# EAGLE design RH021.2 (EAGLE 7.1.0)
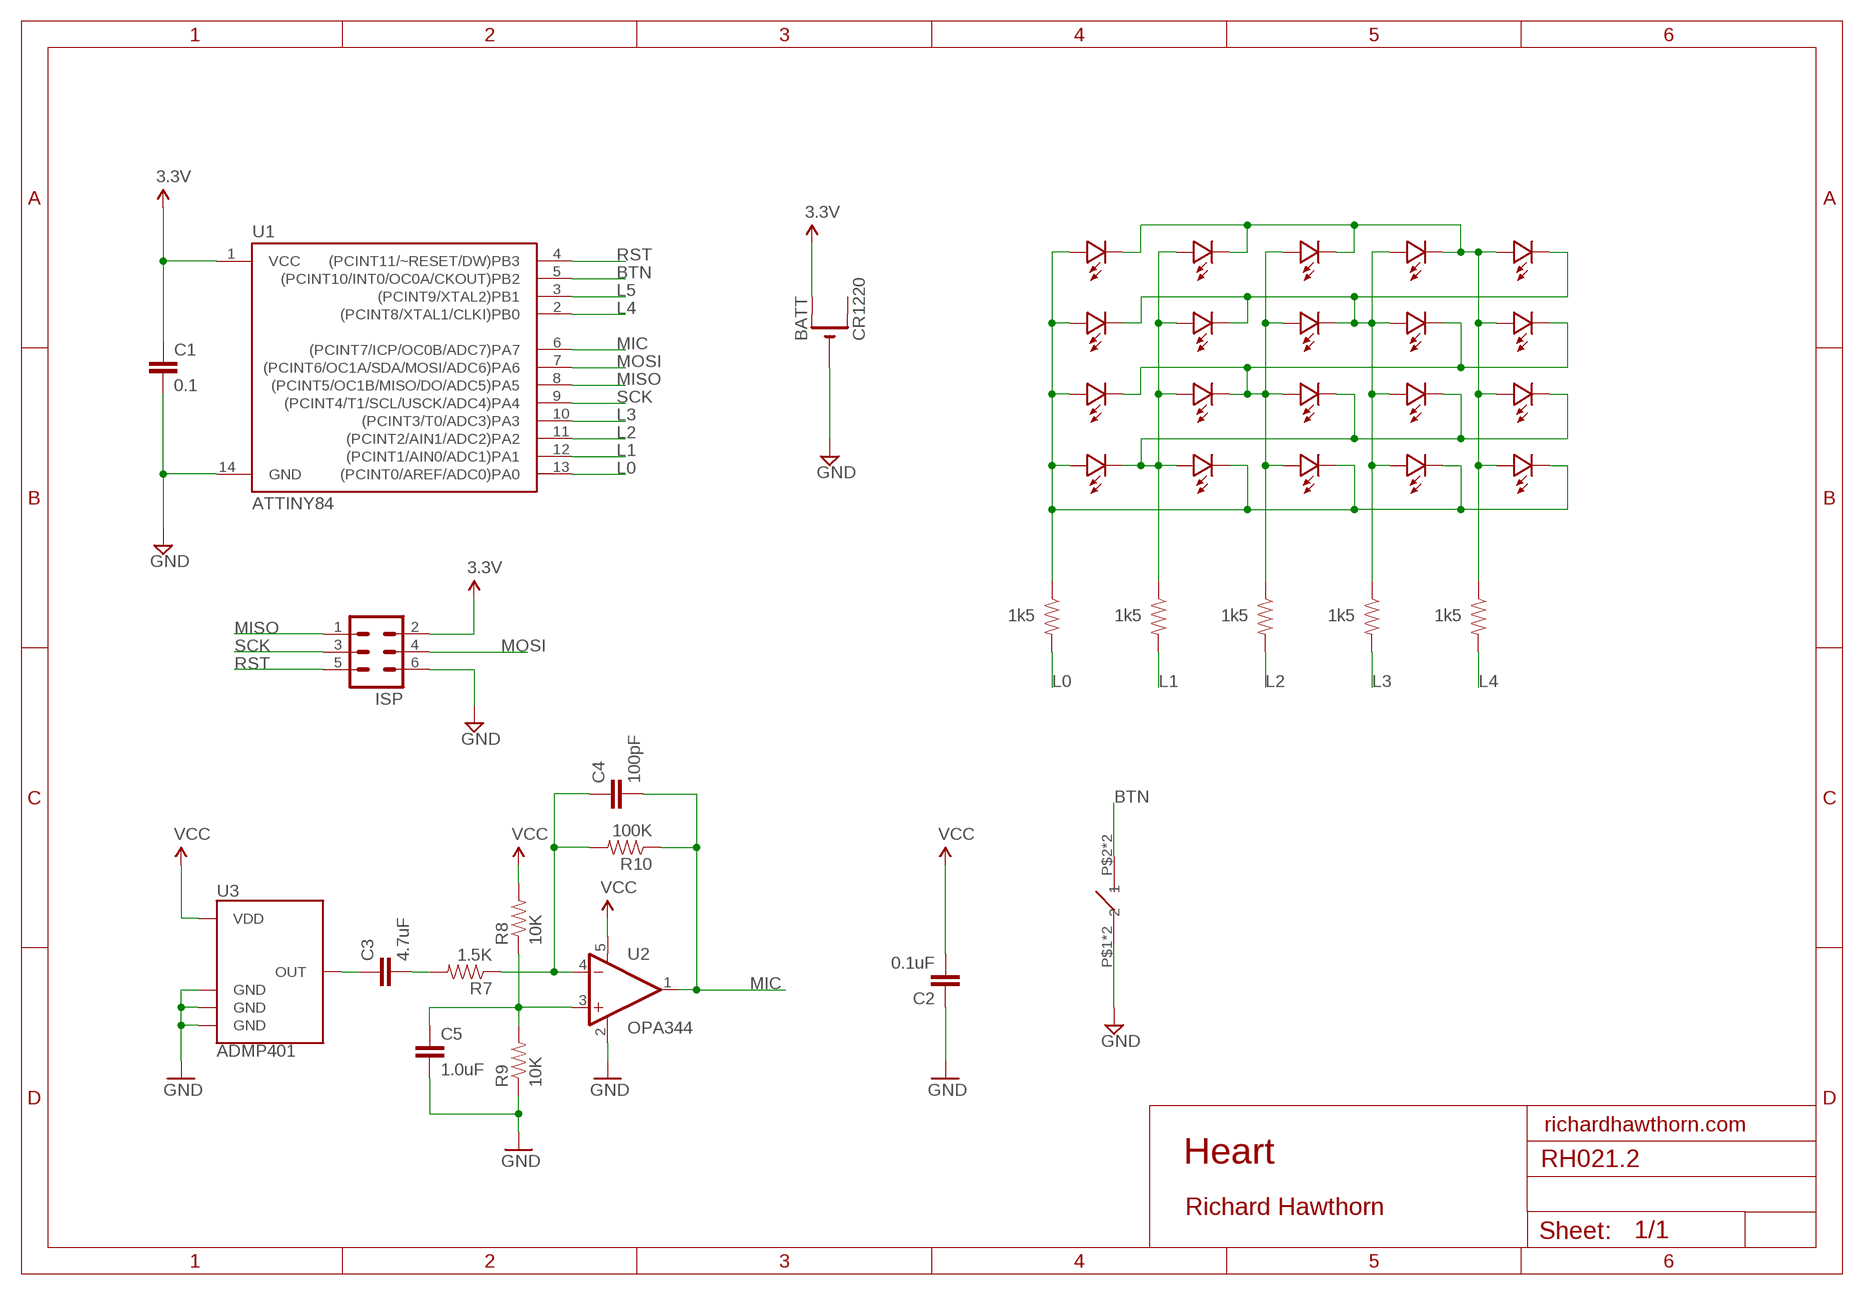
[diagram p0: schematic, sheet 1]

## Parts
BATT  CR1220  CR1220SMT  [CR1220-SMD]
BTN1  TURTLE-3PIN  [TURTLE-3PIN]
C1  0.1  CAP0603-CAP  [0603-CAP]
C2  0.1uF  CAP0402-CAP  [0402-CAP]
C3  4.7uF  CAP0402-CAP  [0402-CAP]
C4  100pF  CAP0402-CAP  [0402-CAP]
C5  1.0uF  CAP0402-CAP  [0402-CAP]
ISP  MA03-2  [MA03-2]
LED1  LED0603  [0603-LED]
LED2  LED0603  [0603-LED]
LED3  LED0603  [0603-LED]
LED4  LED0603  [0603-LED]
LED5  LED0603  [0603-LED]
LED6  LED0603  [0603-LED]
LED7  LED0603  [0603-LED]
LED8  LED0603  [0603-LED]
LED9  LED0603  [0603-LED]
LED10  LED0603  [0603-LED]
LED11  LED0603  [0603-LED]
LED12  LED0603  [0603-LED]
LED13  LED0603  [0603-LED]
LED14  LED0603  [0603-LED]
LED15  LED0603  [0603-LED]
LED16  LED0603  [0603-LED]
LED17  LED0603  [0603-LED]
LED18  LED0603  [0603-LED]
LED19  LED0603  [0603-LED]
LED20  LED0603  [0603-LED]
R1  1k5  RESISTOR0603-RES  [0603-RES]
R2  1k5  RESISTOR0603-RES  [0603-RES]
R3  1k5  RESISTOR0603-RES  [0603-RES]
R4  1k5  RESISTOR0603-RES  [0603-RES]
R5  1k5  RESISTOR0603-RES  [0603-RES]
R7  1.5K  RESISTOR0402-RES  [0402-RES]
R8  10K  RESISTOR0402-RES  [0402-RES]
R9  10K  RESISTOR0402-RES  [0402-RES]
R10  100K  RESISTOR0402-RES  [0402-RES]
U1  ATTINY84  [SO14]
U2  OPA344  [SOT23-5]
U3  ADMP401  [ADMP401]

## Nets
BTN: BTN1.P$2 BTN1.P$4 U1.5((PCINT10/INT0/OC0A/CKOUT)PB2)
C7N$1: C3.1 U3.1(OUT)
GND [power]: BATT.- BTN1.P$1 BTN1.P$3 C1.2 C2.1 C5.2 ISP.6 R9.1 U1.14(GND) U2.2(V-) U3.2(GND) U3.4(GND) U3.6(GND)
L0: R1.2 U1.13((PCINT0/AREF/ADC0)PA0)
L1: R2.2 U1.12((PCINT1/AIN0/ADC1)PA1)
L2: R3.2 U1.11((PCINT2/AIN1/ADC2)PA2)
L3: R4.2 U1.10((PCINT3/T0/ADC3)PA3)
L4: R5.2 U1.2((PCINT8/XTAL1/CLKI)PB0)
L5: U1.3((PCINT9/XTAL2)PB1)
MIC: C4.2 R10.1 U1.6((PCINT7/ICP/OC0B/ADC7)PA7) U2.1(OUT)
MISO: ISP.1 U1.8((PCINT5/OC1B/MISO/DO/ADC5)PA5)
MOSI: ISP.4 U1.7((PCINT6/OC1A/SDA/MOSI/ADC6)PA6)
N$2: C4.1 R7.1 R10.2 U2.4(-IN)
N$6: C3.2 R7.2
N$7: C5.1 R8.1 R9.2 U2.3(+IN)
N$12: LED2.PLUS LED7.PLUS LED12.PLUS LED13.MINUS LED14.MINUS LED15.MINUS LED16.MINUS LED17.PLUS R2.1
N$22: LED1.PLUS LED6.PLUS LED11.PLUS LED16.PLUS LED17.MINUS LED18.MINUS LED19.MINUS LED20.MINUS R1.1
N$32: LED1.MINUS LED2.MINUS LED3.MINUS LED4.MINUS LED5.PLUS LED10.PLUS LED15.PLUS LED20.PLUS R5.1
N$41: LED4.PLUS LED5.MINUS LED6.MINUS LED7.MINUS LED8.MINUS LED9.PLUS LED14.PLUS LED19.PLUS R4.1
N$50: LED3.PLUS LED8.PLUS LED9.MINUS LED10.MINUS LED11.MINUS LED12.MINUS LED13.PLUS LED18.PLUS R3.1
RST: ISP.5 U1.4((PCINT11/~RESET/DW)PB3)
SCK: ISP.3 U1.9((PCINT4/T1/SCL/USCK/ADC4)PA4)
VCC: BATT.+$1(+) C1.1 C2.2 ISP.2 R8.2 U1.1(VCC) U2.5(V+) U3.5(VDD) ; supply symbol labelled 3.3V
Unconnected: BATT.+$2(+1)

## Notes on the sheet
- richardhawthorn.com
- Heart
- Richard Hawthorn

## Library data of the parts
BATT = adafruit:CR1220: CR1216/CR1220/CR1225 12mm 3V lithium coin cell Great for battery packup. Both SMT and THM holders. Note the THM package has the ground pads on both sides of the PCB so that the masks are the same - this reduces the cost
BTN1 = Richards:TURTLE-3PIN
C1 = LowPowerLab:CAP: Capacitor Standard 0603 ceramic capacitor, and 0.1" leaded capacitor.
C2-C5 = SparkFun:CAP: Capacitor Standard 0603 ceramic capacitor, and 0.1" leaded capacitor.
ISP = Richards:MA03-2: PIN HEADER; OC_FARNELL: unknown; OC_NEWARK: unknown
LED1-LED20 = LowPowerLab:LED
R1-R5 = LowPowerLab:RESISTOR: Resistor
R7-R10 = SparkFun:RESISTOR: Resistor
U1 = SparkFun-DigitalIC:ATTINY84: Atmel 14-pin 2/4/8kB flash uC
U2 = SparkFun:OPA344
U3 = SparkFun:ADMP401

## Net classes
1 power: width 0.381 mm, clearance 0.254 mm

## Board
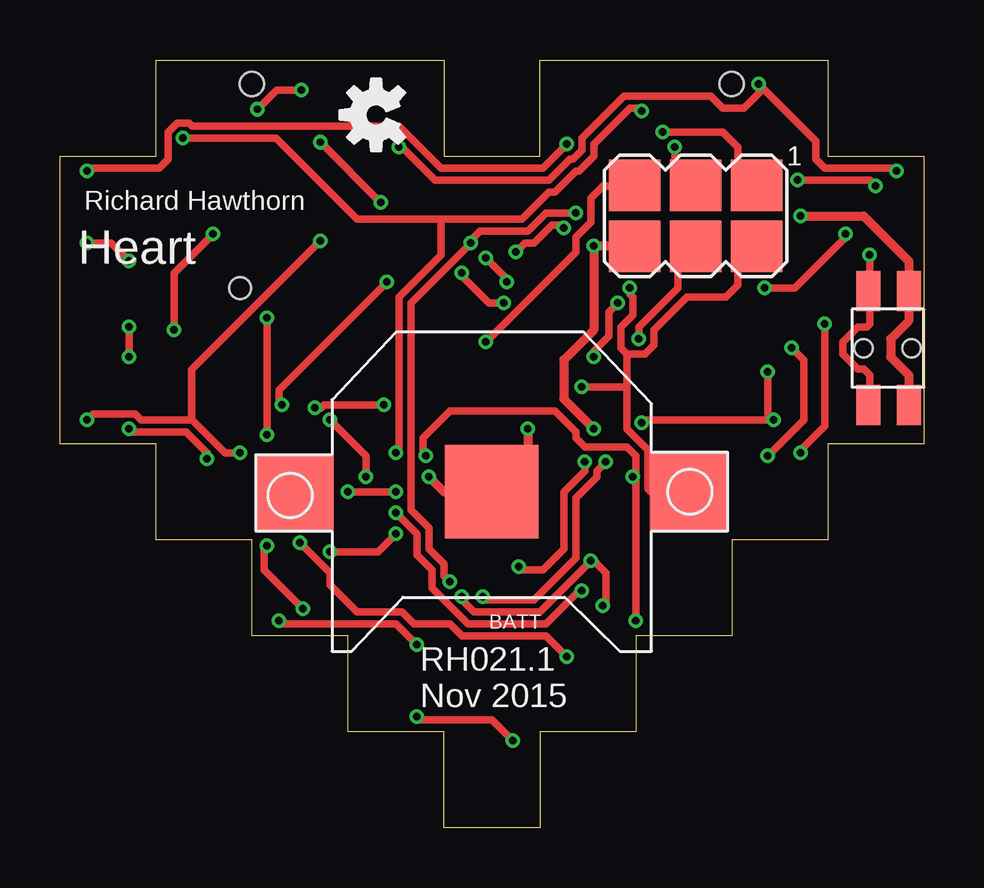
[diagram p1: board, top side]
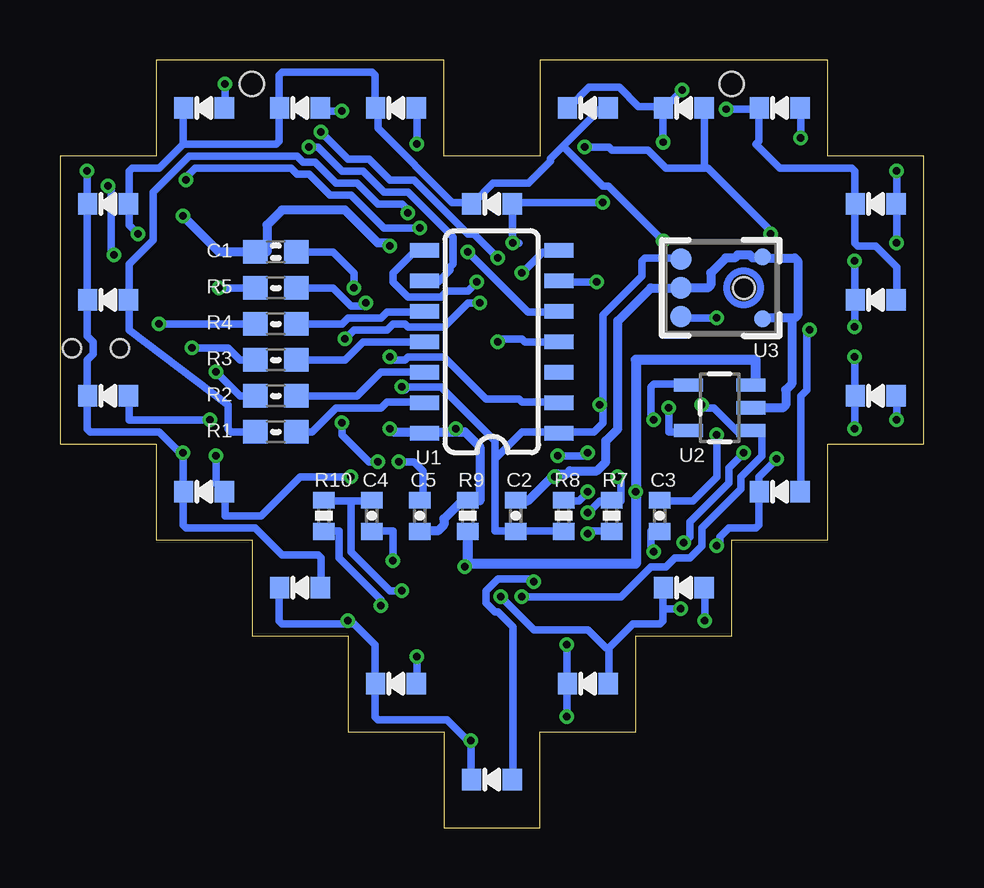
[diagram p2: board, bottom side, seen from below]

Size 36 x 32 mm. Coordinates in mm from the lower left corner, seen from the top.
Outline: 4,32 16,32 16,28 20,28 20,32 32,32 32,28 36,28 36,16 32,16 32,12 28,12 28,8 24,8 24,4 20,4 20,0 16,0 16,4 12,4 12,8 8,8 8,12 4,12 4,16 0,16 0,28 4,28 4,32
Copper layers (1*16): Top 0.035mm / dielectric 1.5mm / Bottom 0.035mm
Design rules "ITEADstudio_DRC *": minimum track width 12mil, minimum drill 12mil, track to track 6mil, track to pad 6mil, pad to pad 6mil, via to via 6mil, smd to smd 0mil, copper to edge 10mil, drill to drill 10mil, minimum pad ring 10mil, minimum via ring 6mil, stop-mask expansion 2mil, vias tented up to drill 100mil, thermal gap 15mil
Holes 1 mm at 8,31 28,31
tRestrict: area 24.3,8.9 to 29.1,12.8; area 5.8,16.9 to 6.9,18.5; area 5.2,9.7 to 6.7,10.4
bRestrict: area 27.4,17.7 to 29.2,18.7; area 21.1,13.8 to 22.9,14.9; area 21.6,12.6 to 22.1,13.2; area 20.7,12.6 to 21.2,13.2; area 20.2,12.8 to 20.7,13.5; area 20.1,13.4 to 20.6,14; area 26.5,18.9 to 27.1,19.5; area 26.5,17.9 to 27.1,18.5; area 27.5,19.1 to 28,19.8; area 27.9,18.8 to 29.1,19.6

### Footprints (pad centres in the part's own frame; a part is rotated, then mirrored left to right if it is on the bottom)
CR1220-SMD = smd 3.2 x 3.2: +$1 -8.2,0; +$2 8.2,0 | smd 3.9 x 3.9: - 0,0
TURTLE-3PIN = smd 1.676 x 1: P$1 -2.39,-0.889; P$2 -2.39,0.811; P$3 2.36,-0.889; P$4 2.36,0.811 | hole 0.75: -0.015,-1; -0.015,1
0603-CAP = smd 1.016 x 0.965: 1 -0.85,0; 2 0.85,0
0402-CAP = smd 0.7 x 0.9: 1 -0.65,0; 2 0.65,0
MA03-2 = smd 2.159 x 2.159: 1 -2.54,-1.27; 2 -2.54,1.27; 3 0,-1.27; 4 0,1.27; 5 2.54,-1.27; 6 2.54,1.27
0603-LED = smd 0.8 x 0.9: MINUS -0.85,0; PLUS 0.85,0
0603-RES = smd 1.016 x 0.965: 1 -0.85,0; 2 0.85,0
0402-RES = smd 0.7 x 0.9: 1 -0.65,0; 2 0.65,0
SO14 = smd 0.6 x 1.2: 1 -3.81,-2.8; 2 -2.54,-2.8; 3 -1.27,-2.8; 4 0,-2.8; 5 1.27,-2.8; 6 2.54,-2.8; 7 3.81,-2.8; 8 3.81,2.8; 9 2.54,2.8; 10 1.27,2.8; 11 0,2.8; 12 -1.27,2.8; 13 -2.54,2.8; 14 -3.81,2.8
SOT23-5 = smd 0.55 x 1.2: 1 -0.95,-1.3; 2 0,-1.3; 3 0.95,-1.3; 4 0.95,1.3; 5 -0.95,1.3
ADMP401 = smd 0.9 x 0.9: 1 -1.2,2.62; 5 1.2,2.62; 6 0,2.62 | smd 0.7 x 0.7: 2 1.3,-0.8; 4 -1.3,-0.8 | hole 0.9: 0,0

### Placement (x,y rotation side)
BATT  18,14 180 top
BTN1  34.5,20 90 top
C1  27,24 180 bottom
C2  17,13 270 bottom
C3  11,13 270 bottom
C4  23,13 270 bottom
C5  21,13 270 bottom
ISP  26.5,25.5 180 top
LED1  18,26 0 bottom
LED2  22,30 0 bottom
LED3  26,30 0 bottom
LED4  30,30 0 bottom
LED5  34,26 0 bottom
LED6  34,22 0 bottom
LED7  34,18 0 bottom
LED8  30,14 0 bottom
LED9  26,10 0 bottom
LED10  22,6 0 bottom
LED11  18,2 0 bottom
LED12  14,6 0 bottom
LED13  10,10 0 bottom
LED14  6,14 0 bottom
LED15  2,18 0 bottom
LED16  2,22 0 bottom
LED17  2,26 0 bottom
LED18  6,30 0 bottom
LED19  10,30 0 bottom
LED20  14,30 0 bottom
R1  27,16.5 0 bottom
R2  27,18 0 bottom
R3  27,19.5 0 bottom
R4  27,21 0 bottom
R5  27,22.5 0 bottom
R7  13,13 270 bottom
R8  15,13 270 bottom
R9  19,13 270 bottom
R10  25,13 90 bottom
U1  18,20.25 90 bottom
U2  8.5,17.5 90 bottom
U3  7.5,22.5 90 bottom
U$3  [OSHW-LOGO-S]  13.17,29.71 90 top

### Tracks (layer width: path | path; a pad name or v marks a point on that pad's centre or on a via)
BTN  (via drill 0.3)
  Top 0.305: BTN1.P$2 33.75,17.62 33.75,18.88 33.5,19.12 33.25,19.12 32.62,19.75 32.62,20.25 33.25,20.88 33.62,20.88 33.75,21 33.75,22.25 BTN1.P$4 33.75,22.5 v33.75,23.88 | v19,24 19.38,24.38 19.75,24.38 20.5,25.12 20.88,25.12 v21,25 | v30.75,27 33.75,27 v34,26.75
  Bottom 0.305: v19,24 16.5,21.5 15.25,21.5 U1.5 | v21,25 22.5,25 23.88,26.38 24.75,26.38 25.62,27.25 26.12,27.25 26.38,27.5 30.38,27.5 30.75,27.12 v30.75,27 | v34,26.75 33.88,26.62 33.88,24 v33.75,23.88
C7N$1  (via drill 0.3)
  Top 0.305: v8.62,21.25 v8.62,16.38
  Bottom 0.305: v8.62,16.38 8.62,14.62 9.62,13.62 11,13.62 C3.1 | v8.62,21.25 10,21.25 U3.1
GND  (via drill 0.3)
  Top 0.381: v15.38,14.62 16,14 BATT.- 19.38,14 19.5,14.12 v19.5,16.62 | BTN1.P$1 35.38,17.62 35.38,18.88 34.62,19.62 34.62,20.38 35.38,21.12 35.38,22.25 BTN1.P$3 35.38,22.5 35.38,23.62 33.5,25.5 v30.88,25.5 | ISP.6 23.88,24.25 v22.25,24.25 22.25,20.75 21,19.5 21,17.88 v22.25,16.62
  Bottom 0.381: 5.5,21.25 5.38,21.25 5.25,21.38 5.25,23.62 5.38,23.75 6.62,23.75 U3.2 6.88,23.75 7.12,23.75 7.25,23.88 7.75,23.88 7.88,23.75 8.25,23.75 8.88,23.12 8.88,22.62 9,22.5 U3.6 11.38,22.5 12.75,21.12 12.75,16.62 13.25,16.12 13.25,15.25 13.62,14.88 14.75,14.88 14.88,14.75 15.25,14.75 v15.38,14.62 15.5,14.62 16.5,13.62 17,13.62 C2.1 | 5.5,21.25 6.62,21.25 U3.4 | U2.2 5.88,17.5 5.75,17.62 5.75,18.25 5.5,18.5 5.5,21.25 | 19.5,16.5 20.75,16.5 U1.14 20.88,16.5 22.12,16.5 v22.25,16.62 | 19.5,16.5 19.12,16.5 18.5,15.88 18.5,13.62 19,13.62 R9.1 19.12,13.75 20,12.88 20,12.62 20.25,12.38 21,12.38 C5.2 | v22.25,24.25 22.38,24.38 22.75,24.38 24.12,25.75 26.75,25.75 27.38,25.12 27.38,24 C1.2 29.38,24 v30.88,25.5 | v19.5,16.62 19.5,16.5
L0
  Bottom 0.305: R1.2 25.5,16.5 24.5,17.5 22.62,17.5 22.38,17.75 20.88,17.75 U1.13
L1
  Bottom 0.305: R2.2 23.62,18 22.62,19 20.88,19 U1.12
L2
  Bottom 0.305: R3.2 24.12,19.5 23.38,20.25 U1.11
L3
  Bottom 0.305: R4.2 24.25,21 24,21.25 22.62,21.25 22.38,21.5 20.88,21.5 U1.10
L4  (via drill 0.3)
  Top 0.305: v23.25,21.88 22.88,21.5 22.88,20.5 22.25,19.88 v22.25,19.62
  Bottom 0.305: R5.2 24.62,22.5 23.88,21.75 23.38,21.75 v23.25,21.88 | v22.25,19.62 22.12,19.5 21.62,19.5 21.5,19.62 20,19.62 18.25,17.88 16.88,17.88 16.75,17.75 15.25,17.75 U1.2
MIC  (via drill 0.3)
  Top 0.305: v13.62,22.75 9.12,18.25 9.12,17.75 v9.25,17.62 | v16.75,9.62 16.75,9.5 17.25,9 20,9 v22.12,11.12 22.25,11.12 22.75,10.62 22.75,9.38 v22.62,9.25
  Bottom 0.305: v13.62,22.75 15.12,22.75 U1.6 | v9.25,17.62 9.12,17.5 8.75,17.5 7.75,16.5 7.25,16.5 U2.1 7.12,16.5 6.75,16.5 6.75,15.5 7.62,14.62 7.62,14.12 9.25,12.5 9.25,11.75 9.75,11.25 10.38,11.25 10.75,10.88 11.38,10.88 12.62,9.62 v16.75,9.62 | v22.12,11.12 22.12,12.38 23,12.38 C4.2 | v22.62,9.25 22.62,9.5 24.38,11.25 24.38,12.38 25,12.38 R10.1
MISO  (via drill 0.3)
  Top 0.305: v25.12,29 27.62,29 28.25,28.38 28.25,26.75 29,26.75 ISP.1 | v17.75,23.75 18.5,23 18.5,22.88 v18.62,22.75
  Bottom 0.305: v25.12,29 24,27.88 23.12,27.88 22.25,27 21.25,27 19,24.75 18.75,24.75 v17.75,23.75 | v18.62,22.75 19,22.38 19.88,22.38 20.12,22.12 21.5,22.12 22.12,22.75 22.12,23.12 21.25,24 20.88,24 U1.8
MOSI  (via drill 0.3)
  Top 0.305: v16.75,23.12 16.75,23 17.88,21.88 v18.5,21.88 | v24.12,20.38 24.12,20.88 25.75,22.5 25.75,24.25 26.5,24.25 ISP.4
  Bottom 0.305: v16.75,23.12 15.88,24 15.25,24 U1.7 | v18.5,21.88 19,21.88 20,20.88 21.5,20.88 21.62,21 22.12,21 22.38,20.75 23.75,20.75 v24.12,20.38
N$2  (via drill 0.3)
  Top 0.305: v12.75,14.62 12.75,15.5 v11.25,17 | v21.75,9.88 21.62,9.88 20.25,8.5 17,8.5 15.5,10 15.5,10.75 14.88,11.38 14.88,12.25 v14,13.12
  Bottom 0.305: 23.88,13.62 25,13.62 R10.2 | 23.88,13.62 23,13.62 C4.1 | v12.75,14.62 12.62,14.5 12.62,13.62 13,13.62 R7.1 13.12,13.62 13.5,13.62 v14,13.12 | v11.25,17 11.38,17.12 11.38,18.38 11.25,18.5 9.88,18.5 U2.4 | 23.88,13.62 23.88,11.5 22.25,9.88 v21.75,9.88
N$6  (via drill 0.3)
  Top 0.305: v11.25,11.5 13.25,11.5 v14,12.25
  Bottom 0.305: v11.25,11.5 11.38,11.62 11.38,12.38 11,12.38 C3.2 | v14,12.25 13.88,12.38 13,12.38 R7.2
N$7  (via drill 0.3)
  Top 0.305: v12,14 v14,14 | v21.88,15.25 21.88,14.88 21,14 21,11.62 20.12,10.75 19.25,10.75 v19.12,10.88
  Bottom 0.305: v14,14 14.38,13.62 15,13.62 R8.1 | v21.88,15.25 21.25,15.25 20.88,14.88 20.88,13.75 21,13.62 C5.1 | v19.12,10.88 19,11
  Bottom 0.406: U2.3 7,18.45 7,19.5 12,19.5 v12,14 12,11 19,11 R9.2
N$12  (via drill 0.3)
  Top 0.305: v24.25,16.88 24.38,17 v29.75,17 29.5,17.25 v29.5,19 | v22.75,15.25 22.38,14.88 22.38,14.62 21.5,13.75 21.5,11.25 19.75,9.5 17.75,9.5 v17.62,9.62 | v6.12,15.38 6.12,15.62 5.25,16.5 3,16.5 v2.88,16.62 | v2.88,19.62 v2.88,20.88 | v1.12,24.38 2.12,24.38 v2.88,23.62 | v21.12,28.5 20.12,27.5 15.88,27.5 14.12,29.25 5.5,29.25 5.38,29.38 4.88,29.38 4.5,29 4.5,27.88 4.12,27.5 1.25,27.5 v1.12,27.38 | v10.12,9.12 8.5,10.75 8.5,11.62 v8.62,11.75
  Bottom 0.305: 13.12,7.5 13.12,6 LED12.PLUS | 13.12,7.5 12.12,8.5 11,8.5 10.88,8.62 10.88,9.12 | 10.88,9.12 10.88,10 LED13.MINUS | v29.75,17 33.12,17 33.12,18 LED7.PLUS | v24.25,16.88 24.25,16.38 23.12,15.25 v22.75,15.25 | v17.62,9.62 16.25,8.25 14,8.25 13.25,7.5 13.12,7.5 | v6.12,15.38 6.88,14.62 6.88,14 LED14.MINUS 6.88,13.88 6.88,12.62 7,12.5 8.12,12.5 8.5,12.12 8.5,11.88 v8.62,11.75 | v2.88,16.62 2.88,18 LED15.MINUS 2.88,18.12 v2.88,19.62 | v2.88,20.88 2.88,22 LED16.MINUS 2.88,22.12 v2.88,23.62 | v1.12,24.38 1.12,26 LED17.PLUS 1.12,26.12 v1.12,27.38 | v21.12,28.5 21.12,30 LED2.PLUS | v10.12,9.12 10.88,9.12 | R2.1 28.5,18 v29.5,19
N$22  (via drill 0.3)
  Top 0.305: v16.25,10.25 16,10.5 16,11 15.38,11.62 15.38,12.5 14.62,13.25 14.62,21.88 v17.12,24.38 17.12,24.5 17.5,24.88 19.5,24.88 20.25,25.62 v21.5,25.62 | v10.86,28.57 v13.37,26.06 | v10.06,30.75 9.03,30.75 v8.23,29.95
  Bottom 0.305: LED16.PLUS 1.12,22 1.12,23.38 2,24.25 2.75,24.25 2.88,24.38 2.88,26 LED17.MINUS 2.88,26.12 2.88,27.38 3,27.5 6,27.5 7,28.5 6.88,28.62 6.88,30 LED18.MINUS 6.97,29.95 v8.23,29.95 | R1.1 28.88,16.5 29,16.62 29,17.62 33.12,20.75 33.12,22 LED6.PLUS 33.12,22.12 33.12,23.5 32.12,24.5 32.12,26.5 30.62,28 26.12,28 25.88,27.75 25.38,27.75 24.5,26.88 23.62,26.88 22.75,26 21.75,26 21.5,25.75 v21.5,25.62 | v16.25,10.25 16.38,10.38 17.75,10.38 18.25,9.88 18.25,9.38 17.88,9 17.75,9 17.12,8.38 17.12,2 LED11.PLUS | 16.88,24.38 v17.12,24.38 17.14,24.46 17.14,25.95 LED1.PLUS 17.03,26.06 v13.37,26.06 | LED19.MINUS 10.86,30.06 11.89,30.06 12.69,30.86 13.95,30.86 14.74,30.06 LED20.MINUS | v10.86,28.57 10.86,29.95 LED19.MINUS | v10.06,30.75 10.74,30.06 LED19.MINUS
N$32  (via drill 0.3)
  Top 0.305: v29.38,22.5 30.62,22.5 32.75,24.62 v32.75,24.75 | v21.12,7.12 20.25,8 16.75,8 16.25,8.5 14.75,8.5 14.25,9 12.38,9 11.25,10.12 11.25,10.62 v10,11.88 | v7.5,15.62 6.88,15.62 5.5,17 5.49,17 | 5.49,17 3.38,17 3.12,17.25 1.38,17.25 v1.12,17 | v10.86,24.46 5.49,19.09 5.49,17
  Bottom 0.305: 30.88,28.5 30.88,30 LED4.MINUS | 30.88,28.5 31.88,27.5 33,27.5 33.12,27.38 33.12,26 LED5.PLUS 33.12,25.88 33.12,25.12 v32.75,24.75 | v29.38,22.5 R5.1 | 30.88,28.5 27,28.5 26.88,28.62 26.88,29.88 LED3.MINUS 26.88,30 26.88,31.38 26.75,31.5 23,31.5 22.88,31.38 22.88,30.12 LED2.MINUS 22.75,29.95 22.75,29.15 19.66,26.06 18.97,26.06 LED1.MINUS 18.75,26.06 17.95,26.86 16.46,26.86 15.54,27.77 15.54,27.89 15.03,28.4 | v21.12,7.12 21.12,6 LED10.PLUS | v10,11.88 9.75,12.12 9.75,12.75 8.12,14.38 8.12,15 v7.5,15.62 | v1.12,17 1.12,17.88 LED15.PLUS | 15.03,28.4 13.49,29.95 13.26,29.95 LED20.PLUS | 15.03,28.4 13.37,26.75 13.14,26.75 v10.86,24.46
N$41  (via drill 0.3)
  Top 0.305: v4.75,20.75 4.75,23.12 v6.38,24.75 | v31.88,21 31.88,16.75 30.88,15.75 v30.88,15.62 | v34.88,27.38 34.75,27.5 31.88,27.5 31.5,27.88 31.5,28.62 v29.12,31 29.25,30.75 28.5,30 27.62,30 27.12,30.5 23.5,30.5 21.75,28.75 21.75,28.25 21.38,27.88 21.25,27.88 20.38,27 15.62,27 14.25,28.38 v14.12,28.38
  Bottom 0.305: v4.75,20.75 4.88,20.62 4.88,18.25 5.12,18 5.12,14 LED14.PLUS | v6.38,24.75 6.38,24.88 9,27.5 | 9,27.5 10.75,27.5 11.5,28.25 13,28.25 13.12,28.38 v14.12,28.38 | LED9.PLUS 25.12,10 25.12,11.25 25.25,11.38 26.75,11.38 27.88,12.5 30.75,12.5 30.88,12.62 30.88,14 LED8.MINUS 30.88,14.12 v30.88,15.62 31,15.62 31.88,16.5 34.75,16.5 34.88,16.62 34.88,17.88 LED7.MINUS 34.88,18 34.88,19.5 34.62,19.75 34.62,20.25 34.88,20.5 34.88,22 LED6.MINUS 34.88,22.12 34.88,25.88 LED5.MINUS 34.88,26 v34.88,27.38 | v31.88,21 R4.1 | v29.12,31 29.12,30 LED4.PLUS | LED19.PLUS 9.14,29.95 9.14,27.55 9,27.5
N$50  (via drill 0.3)
  Top 0.305: v5.12,28.75 9,28.75 12.38,25.38 15.88,25.38 | 15.88,25.38 19.25,25.38 20.38,26.5 20.62,26.5 21.5,27.38 21.62,27.38 22.25,28 22.25,28.5 23.75,30 24.12,30 v24.25,29.88 | v14.88,7.62 14,8.5 9.25,8.5 v9.12,8.62 | v24,8.62 24,14.5 v23.88,14.62 24,14.62 24,15.5 23.62,15.88 21.88,15.88 21.5,16.25 21.5,16.5 20.62,17.38 16.25,17.38 15.12,16.25 15.12,15.62 v15.25,15.5 | v14.88,4.62 15,4.5 18,4.5 v18.88,3.62 | 15.88,25.38 15.88,23.88 14.12,22.12 14.12,15.75 v14,15.62 | v30.5,20 31,19.5 31,17 v29.5,15.5
  Bottom 0.305: v5.12,28.75 5.12,30 LED18.PLUS | v24.25,29.88 25.12,29.88 25.25,30 LED3.PLUS | v14.88,7.62 14.88,6 LED12.MINUS 14.88,5.88 v14.88,4.62 | v9.12,8.62 9.12,10 LED13.PLUS | 24,8.5 23.75,8.5 22.88,7.62 22.88,6 LED10.MINUS 22.88,5.88 22.88,4.62 22.75,4.5 19.88,4.5 18.88,3.5 | 24,8.5 26.75,8.5 26.88,8.62 26.88,10 LED9.MINUS | 18.88,3.5 18.88,2 LED11.MINUS | v23.88,14.62 26,14.62 27.62,13 29.12,13 29.12,14 LED8.PLUS 29.5,14.35 v29.5,15.5 | v24,8.62 24,8.5 | v18.88,3.62 18.88,3.5 | v14,15.62 14.12,15.5 v15.25,15.5 | R3.1 28.5,19.5 29,20 v30.5,20
RST  (via drill 0.3)
  Top 0.305: v17.75,20.25 21.5,24 21.5,24.62 22.12,25.25 22.12,26.25 22.62,26.75 23.88,26.75 ISP.5
  Bottom 0.305: v17.75,20.25 17.62,20.38 16.75,20.38 16.62,20.25 U1.4
SCK  (via drill 0.3)
  Top 0.305: v25.62,28.38 25.62,26.75 26.5,26.75 ISP.3
  Bottom 0.305: v25.62,28.38 25.25,28.38 24.25,27.38 23.38,27.38 22.5,26.5 21.5,26.5 19.62,24.62 19.62,23.5 19.75,23.38 19.75,23.25 20.25,22.75 20.75,22.75 U1.9
VCC  (via drill 0.3)
  Top 0.305: v23.75,22.5 23.75,22.25 23.88,22.12 23.88,21.38 23.38,20.88 23.38,20 23.62,19.75 | 23.62,18.38 23.62,16.62 24.5,15.75 24.5,14.12 24.62,14 BATT.+$1 | 23.62,18.38 23.62,19.75 | 23.62,19.75 24.38,19.75 24.75,20.12 24.75,20.75 26.12,22.12 27.75,22.12 28.25,22.62 28.25,24.25 29,24.25 ISP.2 | v10.62,17.5 10.88,17.5 11,17.62 v13.5,17.62 | v21.75,18.38 23.62,18.38
  Bottom 0.305: C1.1 24.62,24 23.75,23.12 v23.75,22.5 | R8.2 15,12.38 17,12.38 C2.2 17.12,12.38 17.88,12.38 17.88,15.38 | 13.38,17.62 13.38,21.38 11.75,23 11.75,23.62 11.62,23.75 10.12,23.75 U3.5 | 13.38,17.62 13.38,16.88 13.75,16.5 15.12,16.5 U1.1 15.25,16.5 16.75,16.5 17.88,15.38 | v10.62,17.5 10.62,16.5 9.88,16.5 U2.5 | v13.5,17.62 13.38,17.62 | v21.75,18.38 21.62,18.25 21.5,18.38 20.12,18.38 17.88,16.12 17.88,15.38

### Text on the board
tNames: Richard Hawthorn | Heart | RH021.1 / Nov 2015
tDocu: REG